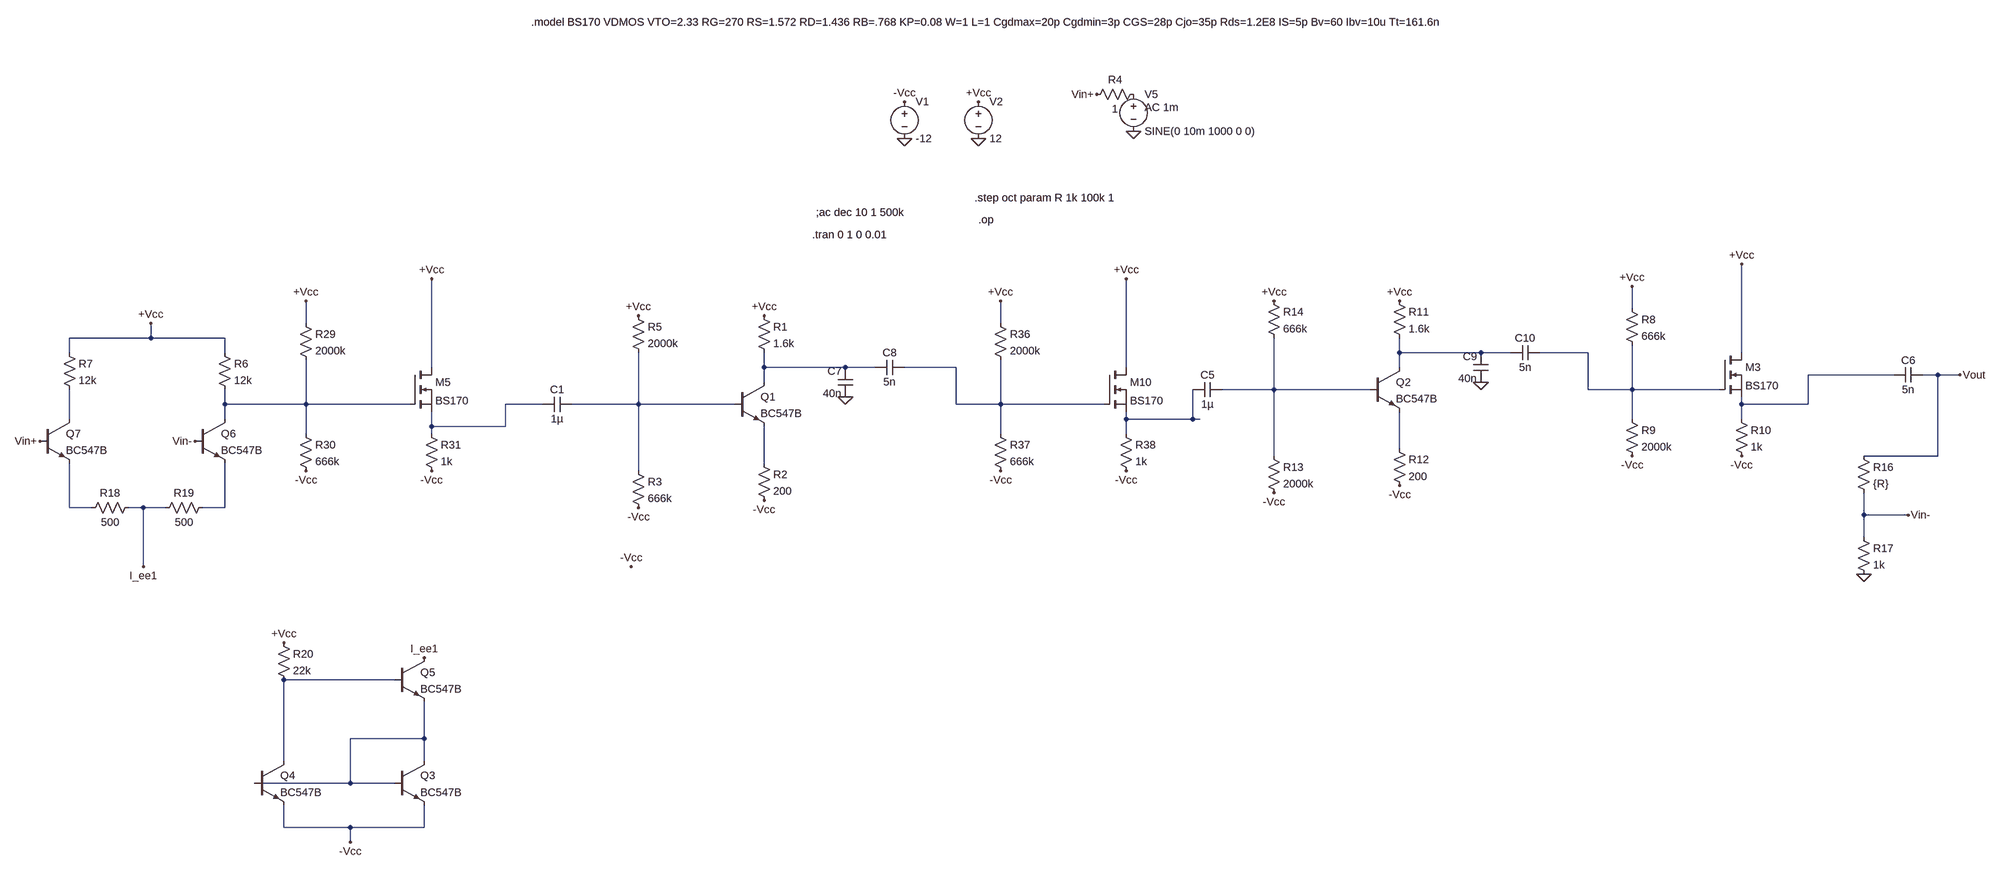
[diagram p0: schematic yay.asc]
yay.asc, the LTspice schematic file:
Version 4
SHEET 1 4264 732
WIRE 768 -1392 768 -1440
WIRE -2112 -1360 -2112 -1408
WIRE -608 -1360 -608 -1408
WIRE -2448 -1328 -2448 -1360
WIRE -2448 -1328 -2624 -1328
WIRE -2288 -1328 -2448 -1328
WIRE -2624 -1296 -2624 -1328
WIRE -2288 -1296 -2288 -1328
WIRE 256 -1296 256 -1328
WIRE 432 -1296 256 -1296
WIRE 496 -1296 432 -1296
WIRE 672 -1296 560 -1296
WIRE 1040 -1296 1040 -1488
WIRE -1840 -1264 -1840 -1456
WIRE -1120 -1264 -1120 -1296
WIRE -944 -1264 -1120 -1264
WIRE -880 -1264 -944 -1264
WIRE -704 -1264 -816 -1264
WIRE -336 -1264 -336 -1456
WIRE 256 -1264 256 -1296
WIRE 1392 -1248 1184 -1248
WIRE 1488 -1248 1456 -1248
WIRE 1536 -1248 1488 -1248
WIRE -1120 -1232 -1120 -1264
WIRE -16 -1216 -16 -1328
WIRE -16 -1216 -128 -1216
WIRE 192 -1216 -16 -1216
WIRE 672 -1216 672 -1296
WIRE 768 -1216 768 -1312
WIRE 768 -1216 672 -1216
WIRE 992 -1216 768 -1216
WIRE -2288 -1184 -2288 -1216
WIRE -2112 -1184 -2112 -1280
WIRE -2112 -1184 -2288 -1184
WIRE -1888 -1184 -2112 -1184
WIRE -1600 -1184 -1680 -1184
WIRE -1392 -1184 -1392 -1296
WIRE -1392 -1184 -1536 -1184
WIRE -1184 -1184 -1392 -1184
WIRE -704 -1184 -704 -1264
WIRE -608 -1184 -608 -1280
WIRE -608 -1184 -704 -1184
WIRE -384 -1184 -608 -1184
WIRE 1040 -1184 1040 -1200
WIRE 1184 -1184 1184 -1248
WIRE 1184 -1184 1040 -1184
WIRE -2624 -1152 -2624 -1216
WIRE -2288 -1152 -2288 -1184
WIRE -336 -1152 -336 -1168
WIRE -192 -1152 -192 -1216
WIRE -192 -1152 -336 -1152
WIRE -176 -1152 -192 -1152
WIRE 768 -1152 768 -1216
WIRE 1040 -1152 1040 -1184
WIRE -1840 -1136 -1840 -1168
WIRE -1680 -1136 -1680 -1184
WIRE -1680 -1136 -1840 -1136
WIRE -2112 -1120 -2112 -1184
WIRE -1840 -1120 -1840 -1136
WIRE -608 -1120 -608 -1184
WIRE -336 -1120 -336 -1152
WIRE 256 -1088 256 -1168
WIRE -16 -1072 -16 -1216
WIRE 1488 -1072 1488 -1248
WIRE 1488 -1072 1328 -1072
WIRE -1120 -1056 -1120 -1136
WIRE -1392 -1040 -1392 -1184
WIRE -2624 -960 -2624 -1056
WIRE -2576 -960 -2624 -960
WIRE -2464 -960 -2496 -960
WIRE -2416 -960 -2464 -960
WIRE -2288 -960 -2288 -1056
WIRE -2288 -960 -2336 -960
WIRE 1328 -944 1328 -992
WIRE 1424 -944 1328 -944
WIRE 1328 -896 1328 -944
WIRE -2464 -832 -2464 -960
WIRE -1920 -432 -2160 -432
WIRE -1856 -304 -1856 -384
WIRE -1856 -304 -2016 -304
WIRE -2160 -256 -2160 -432
WIRE -1856 -256 -1856 -304
WIRE -2016 -208 -2016 -304
WIRE -2016 -208 -2224 -208
WIRE -1920 -208 -2016 -208
WIRE -2160 -112 -2160 -160
WIRE -2016 -112 -2160 -112
WIRE -1856 -112 -1856 -160
WIRE -1856 -112 -2016 -112
WIRE -2016 -80 -2016 -112
FLAG -816 -1760 0
FLAG -656 -1760 0
FLAG -816 -1840 -Vcc
FLAG -656 -1840 +Vcc
FLAG -320 -1776 0
FLAG -400 -1856 Vin+
FLAG -608 -1408 +Vcc
FLAG -336 -1456 +Vcc
FLAG -1392 -1376 +Vcc
FLAG -1120 -1376 +Vcc
FLAG -2448 -1360 +Vcc
FLAG 768 -1440 +Vcc
FLAG 1040 -1488 +Vcc
FLAG -16 -1408 +Vcc
FLAG 256 -1408 +Vcc
FLAG -2016 -80 -Vcc
FLAG -2160 -512 +Vcc
FLAG -1856 -480 I_ee1
FLAG -2464 -832 I_ee1
FLAG -1408 -832 -Vcc
FLAG -1392 -960 -Vcc
FLAG -1120 -976 -Vcc
FLAG -608 -1040 -Vcc
FLAG -336 -1040 -Vcc
FLAG -16 -992 -Vcc
FLAG 256 -1008 -Vcc
FLAG 768 -1072 -Vcc
FLAG 1040 -1072 -Vcc
FLAG 1536 -1248 Vout
FLAG 1424 -944 Vin-
FLAG 1328 -816 0
FLAG -2112 -1408 +Vcc
FLAG -1840 -1456 +Vcc
FLAG -2112 -1040 -Vcc
FLAG -1840 -1040 -Vcc
FLAG -944 -1200 0
FLAG 432 -1232 0
FLAG -2688 -1104 Vin+
FLAG -2352 -1104 Vin-
SYMBOL voltage -816 -1856 R0
WINDOW 123 0 0 Left 0
WINDOW 39 0 0 Left 0
SYMATTR InstName V1
SYMATTR Value -12
SYMBOL voltage -656 -1856 R0
WINDOW 123 0 0 Left 0
WINDOW 39 0 0 Left 0
SYMATTR InstName V2
SYMATTR Value 12
SYMBOL voltage -320 -1872 R0
WINDOW 123 24 44 Left 2
WINDOW 39 0 0 Left 0
SYMATTR Value2 AC 1m
SYMATTR InstName V5
SYMATTR Value SINE(0 10m 1000 0 0)
SYMBOL res -304 -1872 R90
WINDOW 0 0 56 VBottom 2
WINDOW 3 32 56 VTop 2
SYMATTR InstName R4
SYMATTR Value 1
SYMBOL nmos -384 -1264 R0
SYMATTR InstName M10
SYMATTR Value BS170
SYMBOL res -624 -1376 R0
SYMATTR InstName R36
SYMATTR Value 2000k
SYMBOL res -624 -1136 R0
SYMATTR InstName R37
SYMATTR Value 666k
SYMBOL res -352 -1136 R0
SYMATTR InstName R38
SYMATTR Value 1k
SYMBOL npn -1184 -1232 R0
SYMATTR InstName Q1
SYMATTR Value BC547B
SYMBOL res -1136 -1392 R0
SYMATTR InstName R1
SYMATTR Value 1.6k
SYMBOL res -1136 -1072 R0
SYMATTR InstName R2
SYMATTR Value 200
SYMBOL res -1408 -1056 R0
SYMATTR InstName R3
SYMATTR Value 666k
SYMBOL res -1408 -1392 R0
SYMATTR InstName R5
SYMATTR Value 2000k
SYMBOL res -2304 -1312 R0
SYMATTR InstName R6
SYMATTR Value 12k
SYMBOL res -2640 -1312 R0
SYMATTR InstName R7
SYMATTR Value 12k
SYMBOL nmos 992 -1296 R0
SYMATTR InstName M3
SYMATTR Value BS170
SYMBOL res 752 -1408 R0
SYMATTR InstName R8
SYMATTR Value 666k
SYMBOL res 752 -1168 R0
SYMATTR InstName R9
SYMATTR Value 2000k
SYMBOL res 1024 -1168 R0
SYMATTR InstName R10
SYMATTR Value 1k
SYMBOL npn 192 -1264 R0
SYMATTR InstName Q2
SYMATTR Value BC547B
SYMBOL res 240 -1424 R0
SYMATTR InstName R11
SYMATTR Value 1.6k
SYMBOL res 240 -1104 R0
SYMATTR InstName R12
SYMATTR Value 200
SYMBOL res -32 -1088 R0
SYMATTR InstName R13
SYMATTR Value 2000k
SYMBOL res -32 -1424 R0
SYMATTR InstName R14
SYMATTR Value 666k
SYMBOL res -2480 -976 R90
WINDOW 0 0 56 VBottom 2
WINDOW 3 32 56 VTop 2
SYMATTR InstName R18
SYMATTR Value 500
SYMBOL res -2320 -976 R90
WINDOW 0 0 56 VBottom 2
WINDOW 3 32 56 VTop 2
SYMATTR InstName R19
SYMATTR Value 500
SYMBOL npn -1920 -256 R0
SYMATTR InstName Q3
SYMATTR Value BC547B
SYMBOL npn -2224 -256 R0
SYMATTR InstName Q4
SYMATTR Value BC547B
SYMBOL npn -1920 -480 R0
SYMATTR InstName Q5
SYMATTR Value BC547B
SYMBOL res -2176 -528 R0
SYMATTR InstName R20
SYMATTR Value 22k
SYMBOL cap -128 -1232 R90
WINDOW 0 0 32 VBottom 2
WINDOW 3 32 32 VTop 2
SYMATTR InstName C5
SYMATTR Value 1µ
SYMBOL cap -1536 -1200 R90
WINDOW 0 0 32 VBottom 2
WINDOW 3 32 32 VTop 2
SYMATTR InstName C1
SYMATTR Value 1µ
SYMBOL cap 1456 -1264 R90
WINDOW 0 0 32 VBottom 2
WINDOW 3 32 32 VTop 2
SYMATTR InstName C6
SYMATTR Value 5n
SYMBOL res 1312 -1088 R0
SYMATTR InstName R16
SYMATTR Value {R}
SYMBOL res 1312 -912 R0
SYMATTR InstName R17
SYMATTR Value 1k
SYMBOL nmos -1888 -1264 R0
SYMATTR InstName M5
SYMATTR Value BS170
SYMBOL res -2128 -1376 R0
SYMATTR InstName R29
SYMATTR Value 2000k
SYMBOL res -2128 -1136 R0
SYMATTR InstName R30
SYMATTR Value 666k
SYMBOL res -1856 -1136 R0
SYMATTR InstName R31
SYMATTR Value 1k
SYMBOL cap -928 -1200 R180
WINDOW 0 24 56 Left 2
WINDOW 3 24 8 Left 2
SYMATTR InstName C7
SYMATTR Value 40n
SYMBOL cap -816 -1280 R90
WINDOW 0 0 32 VBottom 2
WINDOW 3 32 32 VTop 2
SYMATTR InstName C8
SYMATTR Value 5n
SYMBOL cap 448 -1232 R180
WINDOW 0 24 56 Left 2
WINDOW 3 24 8 Left 2
SYMATTR InstName C9
SYMATTR Value 40n
SYMBOL cap 560 -1312 R90
WINDOW 0 0 32 VBottom 2
WINDOW 3 32 32 VTop 2
SYMATTR InstName C10
SYMATTR Value 5n
SYMBOL npn -2688 -1152 R0
SYMATTR InstName Q7
SYMATTR Value BC547B
SYMBOL npn -2352 -1152 R0
SYMATTR InstName Q6
SYMATTR Value BC547B
TEXT -1016 -1552 Left 2 !.tran 0 1 0 0.01
TEXT -1624 -2048 Left 2 !.model BS170 VDMOS VTO=2.33 RG=270 RS=1.572 RD=1.436 RB=.768 KP=0.08 W=1 L=1 Cgdmax=20p Cgdmin=3p CGS=28p Cjo=35p Rds=1.2E8 IS=5p Bv=60 Ibv=10u Tt=161.6n
TEXT -1008 -1600 Left 2 !;ac dec 10 1 500k
TEXT -664 -1632 Left 2 !.step oct param R 1k 100k 1
TEXT -656 -1584 Left 2 !.op

The netlist it stands for:
* yay.asc
V1 -Vcc 0 -12
V2 +Vcc 0 12
V5 P001 0 SINE(0 10m 1000 0 0) AC 1m
R4 P001 Vin+ 1
M10 +Vcc N004 N011 N011 BS170
R36 +Vcc N004 2000k
R37 N004 -Vcc 666k
R38 N011 -Vcc 1k
Q1 N003 N009 N013 0 BC547B
R1 +Vcc N003 1.6k
R2 N013 -Vcc 200
R3 N009 -Vcc 666k
R5 +Vcc N009 2000k
R6 +Vcc N007 12k
R7 +Vcc N010 12k
M3 +Vcc N002 N005 N005 BS170
R8 +Vcc N002 666k
R9 N002 -Vcc 2000k
R10 N005 -Vcc 1k
Q2 N001 N006 N012 0 BC547B
R11 +Vcc N001 1.6k
R12 N012 -Vcc 200
R13 N006 -Vcc 2000k
R14 +Vcc N006 666k
R18 I_ee1 N014 500
R19 N015 I_ee1 500
Q3 N017 N017 -Vcc 0 BC547B
Q4 N016 N017 -Vcc 0 BC547B
Q5 I_ee1 N016 N017 0 BC547B
R20 +Vcc N016 22k
C5 N006 N011 1µ
C1 N009 N008 1µ
C6 Vout N005 5n
R16 Vout Vin- {R}
R17 Vin- 0 1k
M5 +Vcc N007 N008 N008 BS170
R29 +Vcc N007 2000k
R30 N007 -Vcc 666k
R31 N008 -Vcc 1k
C7 0 N003 40n
C8 N004 N003 5n
C9 0 N001 40n
C10 N002 N001 5n
Q7 N010 Vin+ N014 0 BC547B
Q6 N007 Vin- N015 0 BC547B
.model NPN NPN
.model PNP PNP
.lib standard.bjt
.model NMOS NMOS
.model PMOS PMOS
.lib standard.mos
.tran 0 1 0 0.01
.model BS170 VDMOS VTO=2.33 RG=270 RS=1.572 RD=1.436 RB=.768 KP=0.08 W=1 L=1 Cgdmax=20p Cgdmin=3p CGS=28p Cjo=35p Rds=1.2E8 IS=5p Bv=60 Ibv=10u Tt=161.6n
;ac dec 10 1 500k
.step oct param R 1k 100k 1
.op
.backanno
.end